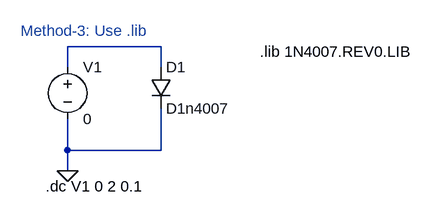
[diagram p0: schematic Method-3 Use lib.asc]
Method-3 Use lib.asc, the LTspice schematic file:
Version 4
SHEET 1 924 680
WIRE 128 96 -16 96
WIRE -16 128 -16 96
WIRE 128 128 128 96
WIRE -16 256 -16 208
WIRE 128 256 128 192
WIRE 128 256 -16 256
WIRE -16 288 -16 256
FLAG -16 288 0
SYMBOL diode 112 128 R0
SYMATTR InstName D1
SYMATTR Value D1n4007
SYMBOL voltage -16 112 R0
WINDOW 123 0 0 Left 0
WINDOW 39 0 0 Left 0
SYMATTR InstName V1
SYMATTR Value 0
TEXT -50 312 Left 2 !.dc V1 0 2 0.1
TEXT -88 72 Left 2 ;Method-3: Use .lib
TEXT 280 104 Left 2 !.lib 1N4007.REV0.LIB

The netlist it stands for:
* Method-3 Use lib.asc
D1 N001 0 D1n4007
V1 N001 0 0
.model D D
.lib standard.dio
.dc V1 0 2 0.1
* Method-3: Use .lib
.lib 1N4007.REV0.LIB
.backanno
.end